# EAGLE design SimpleSwitchPirLightCO2 (EAGLE 6.6.0)
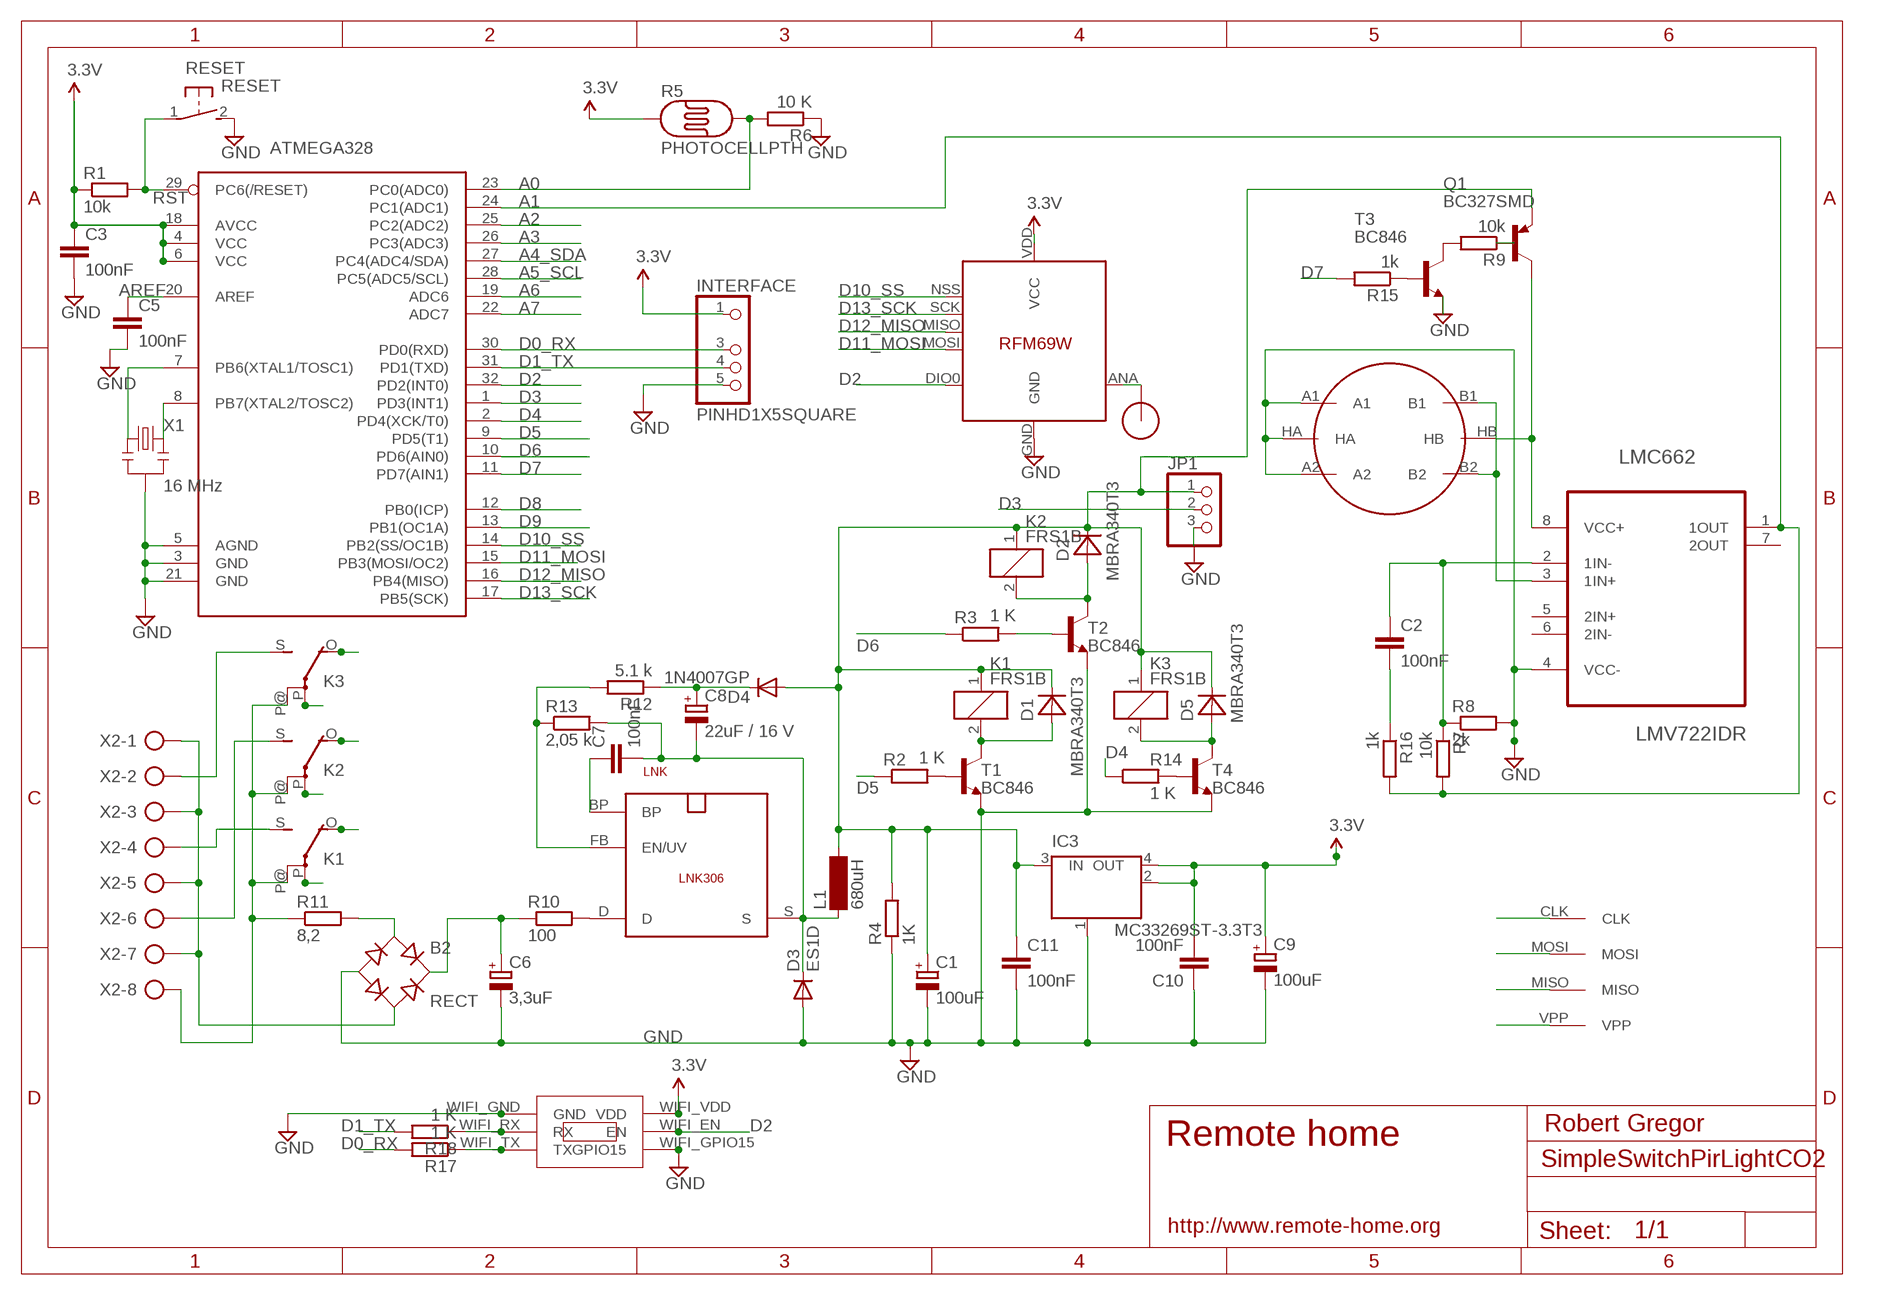
[diagram p0: schematic, sheet 1]

## Parts
ATMEGA328  ATMega-328  ATMEGA168/328TQFP32  [TQFP32-08]
B2  RECT  RECTIFIER-S40  [TO-269AA]
C1  100uF  CPOL-EUSMCB  [SMC_B]
C2  100nF  C-EUC2012  [C2012]
C3  100nF  C-EUC2012  [C2012]
C5  100nF  C-EUC2012  [C2012]
C6  3,3uF  CPOL-EUE5-10.5  [E5-10,5]
C7  100nF  C-EUC2012  [C2012]
C8  22uF / 16 V  CPOL-EUSMCC  [SMC_C]
C9  100uF  CPOL-EUSMCB  [SMC_B]
C10  100nF  C-EUC2012  [C2012]
C11  100nF  C-EUC2012  [C2012]
D1  MBRA340T3  [SMA]
D2  MBRA340T3  [SMA]
D3  ES1D  DIODE-DO214AC  [DO214AC]
D4  1N4007GP  DIODE-DO214AA  [DO214AA]
D5  MBRA340T3  [SMA]
IC3  MC33269ST-3.3T3  [SOT223]
INTERFACE  PINHD1X5SQUARE  [PINHD1X05-SQUARE]
JP1  PINHD-1X03_2.54-S  [1X03-S]
K1  FRS1B  [FRS1B]
K2  FRS1B  [FRS1B]
K3  FRS1B  [FRS1B]
L1  680uH  BS11  [BS11]
LMC662  LMV722IDR  [SOIC127P600X175-8N]
LNK  LNK306  SO-8C  [SO-8C]
Q1  BC327SMD  [SOT23-BEC]
R1  10k  R-EU_R2012  [R2012]
R2  1 K  R-EU_M2012  [M2012]
R3  1 K  R-EU_M2012  [M2012]
R4  1K  R-EU_M2012  [M2012]
R5  PHOTOCELLPTH  [PHOTOCELL]
R6  10 K  R-EU_M2012  [M2012]
R7  10k  R-EU_R2012  [R2012]
R8  2k  R-EU_R2012  [R2012]
R9  10k  R-EU_R2012  [R2012]
R10  100  R-EU_R2512W  [R2512W]
R11  8,2  R-EU_0411/12  [0411/12]
R12  5.1 k  R-EU_M2012  [M2012]
R13  2,05 k  R-EU_M2012  [M2012]
R14  1 K  R-EU_M2012  [M2012]
R15  1k  R-EU_R2012  [R2012]
R16  1k  R-EU_R2012  [R2012]
R17  1 K  R-EU_M2012  [M2012]
R18  1 K  R-EU_M2012  [M2012]
RESET  RESET  DTSM-3  [DTSM-3]
RFM69  RFM69W  [RFM69W]
T1  BC846  [SOT23]
T2  BC846  [SOT23]
T3  BC846  [SOT23]
T4  BC846  [SOT23]
U$1  RFM12B_ANTENNA  [RFM12B-ANTENNA]
U$2  AVRHEADERDIP  [AVRHEADER]
U$4  METHANE_SENSOR  [MQ-3]
U$5  ESP03  [ESP03]
X1  16 MHz  RESONATORSMD  [RESONATOR-SMD]
X2  AK500/8  [AK500/8]

## Nets
6V: C1.+ C11.1 D1.C D2.C D4.A D5.C IC3.3(IN) JP1.1 K1.1 K2.1 K3.1 L1.2 Q1.E R4.2
A0: ATMEGA328.23(PC0(ADC0)) R5.2 R6.2
A1: ATMEGA328.24(PC1(ADC1)) LMC662.1(1OUT) R7.2 R16.2
A2: ATMEGA328.25(PC2(ADC2))
A3: ATMEGA328.26(PC3(ADC3))
A4_SDA: ATMEGA328.27(PC4(ADC4/SDA))
A5_SCL: ATMEGA328.28(PC5(ADC5/SCL))
A6: ATMEGA328.19(ADC6)
A7: ATMEGA328.22(ADC7)
AREF: ATMEGA328.20(AREF) C5.1
D0_RX: ATMEGA328.30(PD0(RXD)) INTERFACE.3 R17.2
D1_TX: ATMEGA328.31(PD1(TXD)) INTERFACE.4 R18.2
D2: ATMEGA328.32(PD2(INT0)) RFM69.DIO0 U$5.WIFI_EN(EN)
D3: ATMEGA328.1(PD3(INT1)) JP1.2
D4: ATMEGA328.2(PD4(XCK/T0)) R14.1
D5: ATMEGA328.9(PD5(T1)) R2.1
D6: ATMEGA328.10(PD6(AIN0)) R3.1
D7: ATMEGA328.11(PD7(AIN1)) R15.2
D8: ATMEGA328.12(PB0(ICP))
D9: ATMEGA328.13(PB1(OC1A))
D10_SS: ATMEGA328.14(PB2(SS/OC1B)) RFM69.NSS(SEL)
D11_MOSI: ATMEGA328.15(PB3(MOSI/OC2)) RFM69.MOSI U$2.MOSI
D12_MISO: ATMEGA328.16(PB4(MISO)) RFM69.MISO U$2.MISO
D13_SCK: ATMEGA328.17(PB5(SCK)) RFM69.SCK U$2.CLK
FB: LNK.FB(EN/UV) R12.2 R13.1
GND [power]: ATMEGA328.3(GND) ATMEGA328.5(AGND) ATMEGA328.21(GND) B2.- C1.- C3.2 C5.2 C6.- C9.- C10.1 C11.2 D3.A IC3.1(GND/ADJ) INTERFACE.5 JP1.3 LMC662.4(VCC-) R4.1 R6.1 R8.2 RESET.2 RFM69.GND T1.2(E) T2.2(E) T3.2(E) T4.2(E) U$4.A1 U$4.A2 U$4.HA U$5.WIFI_GND(GND) U$5.WIFI_GPIO15(GPIO15) X1.2
N$1: ATMEGA328.7(PB6(XTAL1/TOSC1)) X1.1
N$2: R2.2 T1.1(B)
N$3: RFM69.ANA(ANT) U$1.P$1
N$4: LMC662.3(1IN+) U$4.B1 U$4.B2
N$5: D1.A K1.2 T1.3(C)
N$6 [220V]: K3.S(2:S) X2.2
N$7 [220V]: K2.S(2:S) X2.6
N$8 [220V]: K1.P@(2:P) K2.P@(2:P) K3.P@(2:P) R11.1 X2.8
N$9 [220V]: B2.AC2 X2.1 X2.3 X2.5 X2.7
N$10: D5.A K3.2 T4.3(C)
N$11: D2.A K2.2 T2.3(C)
N$12: R3.2 T2.1(B)
N$13 [220V]: LNK.D R10.2
N$14 [220V]: B2.+ C6.+ R10.1
N$15 [220V]: B2.AC1 R11.2
N$16 [220V]: K1.S(2:S) X2.4
N$17: C2.1 LMC662.2(1IN-) R7.1 R8.1
N$18: C7.1 LNK.BP
N$19: LMC662.8(VCC+) Q1.C U$4.HB
N$20: C8.+ D4.C R12.1
N$21: ATMEGA328.8(PB7(XTAL2/TOSC2)) X1.3
N$22: R15.1 T3.1(B)
N$23: R9.2 T3.3(C)
N$24: Q1.B R9.1
N$25: C2.2 R16.1
N$26 [220V]: K3.O(2:O)
N$27: R14.2 T4.1(B)
N$28: R17.1 U$5.WIFI_TX(TX)
N$29: R18.1 U$5.WIFI_RX(RX)
N$50 [220V]: K2.O(2:O)
N$51 [220V]: K1.O(2:O)
N$52 [220V]: K1.P(2:P)
N$53 [220V]: K2.P(2:P)
N$54 [220V]: K3.P(2:P)
RST: ATMEGA328.29(PC6(/RESET)) R1.2 RESET.1 U$2.VPP
S: C7.2 C8.- D3.C L1.1 LNK.S R13.2
VCC: ATMEGA328.4(VCC) ATMEGA328.6(VCC) ATMEGA328.18(AVCC) C3.1 C9.+ C10.2 IC3.2(OUT) IC3.4(OUT) INTERFACE.1 R1.1 R5.1 RFM69.VDD(VCC) U$5.WIFI_VDD(VDD) ; supply symbol labelled 3.3V
Unconnected: LMC662.5(2IN+) LMC662.6(2IN-) LMC662.7(2OUT)

## Notes on the sheet
- Robert Gregor
- Remote home
- http://www.remote-home.org

## Library data of the parts
ATMEGA328 = LowPowerLab:ATMEGA168/328: Atmel 32-pin 8-bit micro, 16k flash.
B2 = rectifier:RECTIFIER-: Rectifier
C1 C6 C8 C9 = resistor:CPOL-EU: POLARIZED CAPACITOR, European symbol
C2 C3 C5 C7 C10 C11 = resistor:C-EU: CAPACITOR, European symbol
D1 D2 D5 = diode:MBRA340T3: Surface Mount Schottky Power Rectifier Source: http://www.onsemi.com/pub_link/Collateral/MBRA340T3-D.PDF
D3 D4 = diode:DIODE-: DIODE
IC3 = linear:MC33269ST*: Adjustable Output Low Dropout Voltage Regulator 800 mA Source: http://www.onsemi.com/pub/Collateral/MC33269-D.PDF
INTERFACE = eagle-library-edeca.net-v5:PINHD1X5
JP1 = pinhead-2:PINHD-1X03: PIN HEADER
K1-K3 = relay:FRS1B: RELAY 1 x switch, same as V23101-D6-A201, Siemens; OC_FARNELL: unknown; OC_NEWARK: unknown
L1 = inductor-neosid:BS: INDUCTOR nominal inductance, magnetically screened; OC_FARNELL: unknown; OC_NEWARK: unknown
LMC662 = Texas Instruments_By_element14_Batch_1:LMV722IDR: OPERATIONAL AMPLIFIERS; MPN: LMV722IDR; OC_FARNELL: -; OC_NEWARK: 02M3640; PACKAGE: SOIC-8; SUPPLIER: Texas Instruments
LNK = powerint:SO-8C: 700V MOSFET für Schaltnetz-Trafos. Pin 3 fehlt. SMD
Q1 = transistor-pnp:BC327*: PNP Transistror
R1-R4 R6-R18 = resistor:R-EU_: RESISTOR, European symbol
R5 = SparkFun-Sensors:PHOTOCELL: CdS photoresistor. This is a low cost way to detect light levels. Resistance decreases with more incoming light. SparkFun SKU: SEN-09088
RESET = switch-tact:DTSM-3
RFM69 = RemoteHome:RFM69W
T1-T4 = transistor:BC846: NPN TRANSISTOR
U$1 = LowPowerLab:RFM12B_ANTENNA
U$2 = RemoteHome:AVRHEADER
U$4 = SparkFun-Sensors:METHANE_SENSOR: MQ-4 Methane Gas Sensor SEN-09404
U$5 = RemoteHome:ESP03
X1 = SparkFun:RESONATOR: Resonator Small SMD resonator. This is the itty bitty 10/20MHz resonators with built in caps. CSTCE10M0G55 and CSTCE20M0V53. Footprint has been reviewed closely but hasn't been tested yet.
X2 = con-ptr500:AK500/8: CONNECTOR; OC_FARNELL: unknown; OC_NEWARK: unknown

## Net classes
1 power: width 0.381 mm, clearance 0.254 mm
2 220V: width 0.381 mm, clearance 0.508 mm

## Board
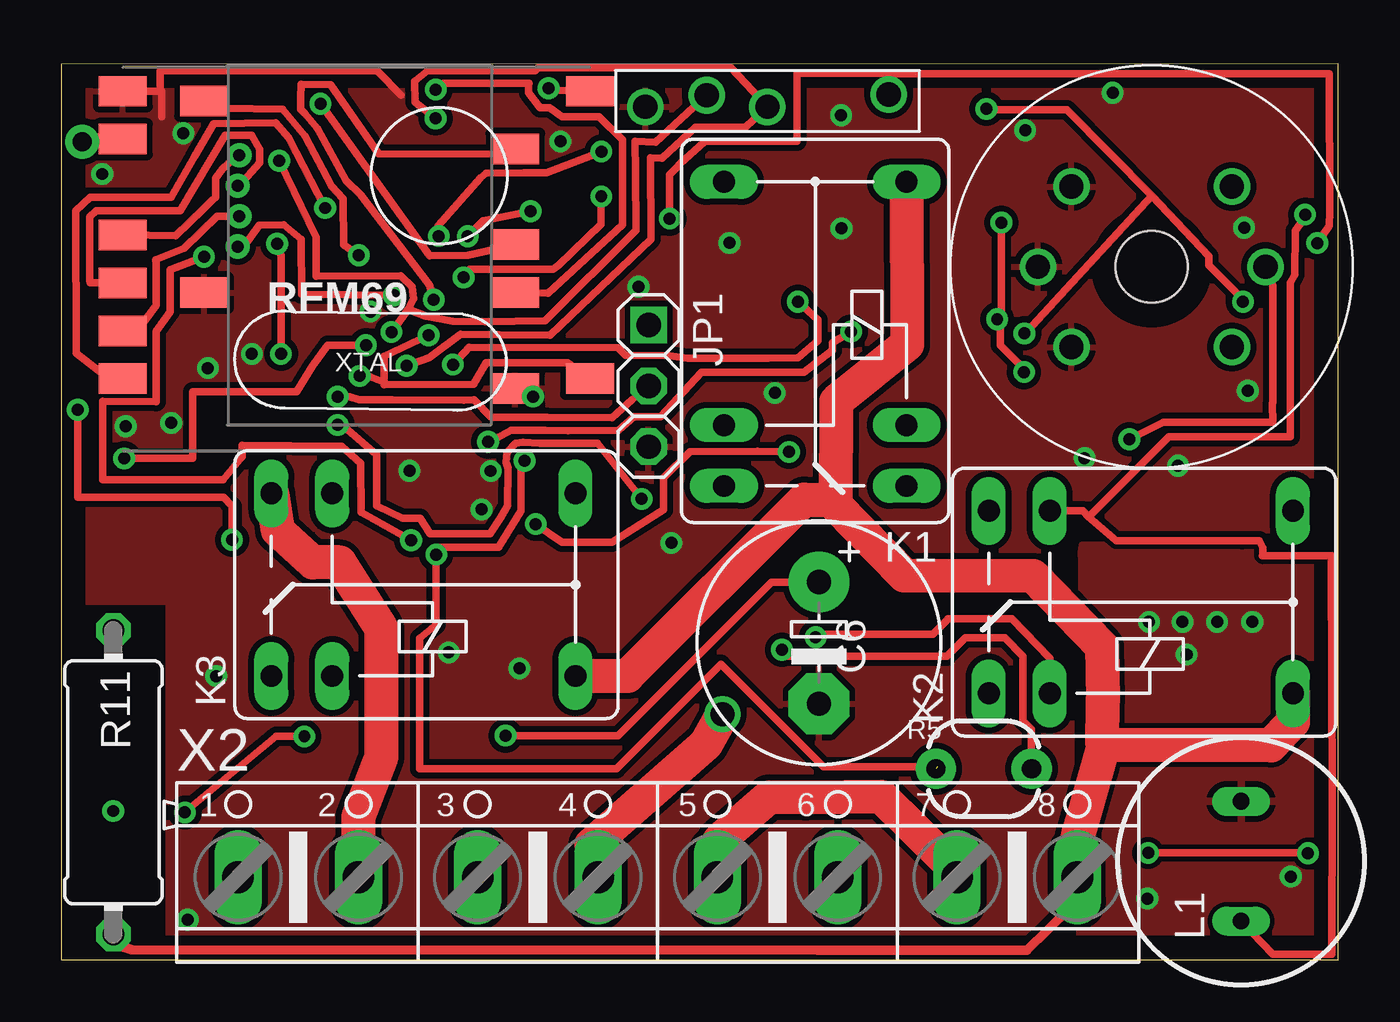
[diagram p1: board, top side]
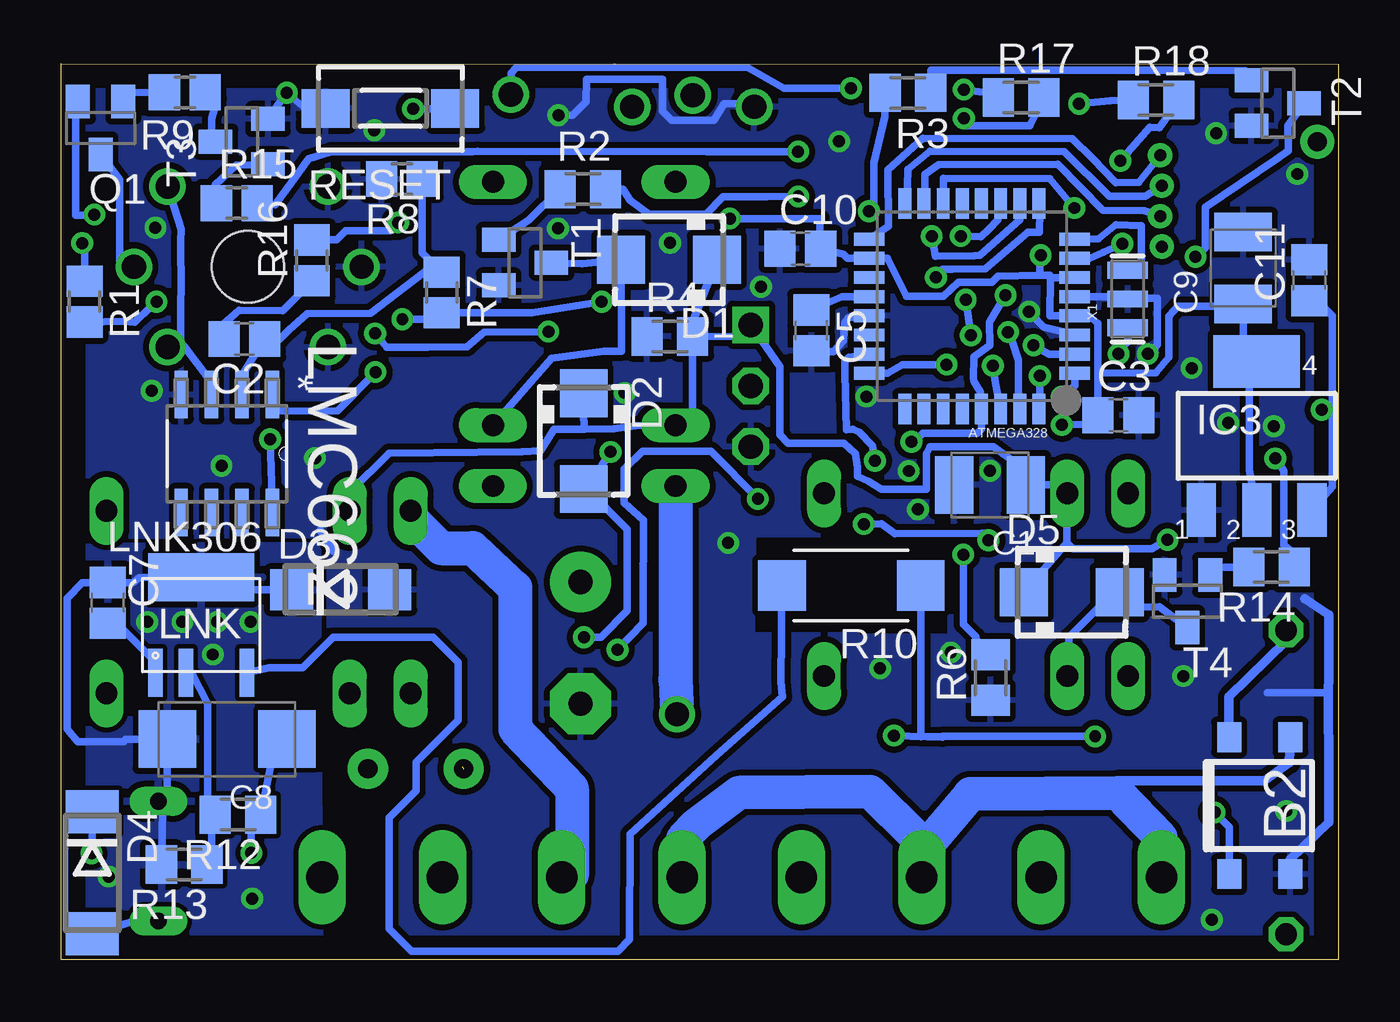
[diagram p2: board, bottom side, seen from below]

Size 53.33 x 37.42 mm. Coordinates in mm from the lower left corner, seen from the top.
Outline: 0,0 53.33,0 53.33,37.42 0,37.4 0,0
Copper layers (1*16): Top 0.035mm / dielectric 1.5mm / Bottom 0.035mm
Design rules "default": minimum track width 10mil, minimum drill 24mil, track to track 8mil, track to pad 8mil, pad to pad 8mil, via to via 8mil, smd to smd 8mil, copper to edge 40mil, drill to drill 8mil, minimum pad ring 10mil, minimum via ring 8mil, stop-mask expansion 4mil, vias tented up to drill 0mil, thermal gap 10mil

### Footprints (pad centres in the part's own frame; a part is rotated, then mirrored left to right if it is on the bottom)
TQFP32-08 = smd 1.27 x 0.533: 1 -4.293,2.8; 2 -4.293,2; 3 -4.293,1.2; 4 -4.293,0.4; 5 -4.293,-0.4; 6 -4.293,-1.2; 7 -4.293,-2; 8 -4.293,-2.8; 17 4.293,-2.8; 18 4.293,-2; 19 4.293,-1.2; 20 4.293,-0.4; 21 4.293,0.4; 22 4.293,1.2; 23 4.293,2; 24 4.293,2.8 | smd 0.533 x 1.27: 9 -2.8,-4.293; 10 -2,-4.293; 11 -1.2,-4.293; 12 -0.4,-4.293; 13 0.4,-4.293; 14 1.2,-4.293; 15 2,-4.293; 16 2.8,-4.293; 25 2.8,4.293; 26 2,4.293; 27 1.2,4.293; 28 0.4,4.293; 29 -0.4,4.293; 30 -1.2,4.293; 31 -2,4.293; 32 -2.8,4.293
TO-269AA = smd 1 x 1.25: + -1.28,-2.855; - 1.28,-2.855; AC1 -1.28,2.855; AC2 1.28,2.855
SMC_B = smd 1.6 x 2.4: + -1.5,0; - 1.5,0
C2012 = smd 1.3 x 1.5: 1 -0.85,0; 2 0.85,0
E5-10,5 = drill 1.016 pad 2.54: + -2.54,0 | drill 1.016 pad 2.54 octagon: - 2.54,0
SMC_C = smd 2.4 x 2.4: + -2.5,0; - 2.5,0
SMA = smd 2 x 2: A 2,0; C -2,0
DO214AC = smd 1.8 x 1.7: A 2.05,0; C -2.05,0
DO214AA = smd 1.8 x 2.2: A 2.55,0; C -2.55,0
SOT223 = smd 1.219 x 2.235: 1 -2.311,-3.099; 2 0,-3.099; 3 2.311,-3.099 | smd 3.6 x 2.2: 4 0,3.099
PINHD1X05-SQUARE = drill 1.016: 1 -5.061,-0.269; 3 0,0.24; 4 2.54,-0.24; 5 5.099,0.24
1X03-S = drill 1.016 square: 1 -2.54,0 | drill 1.016 octagon: 2 0,0; 3 2.54,0
FRS1B = drill 0.914 long: 1 0,3.81; 2 0,-3.81; O -2.54,-3.81; P 10.16,3.81; P@ 10.16,-3.81; S -2.54,3.81
BS11 = drill 0.7 long: 1 -2.5,0; 2 2.5,0
SOIC127P600X175-8N = smd 1.981 x 0.559: 1 -2.464,1.905; 2 -2.464,0.635; 3 -2.464,-0.635; 4 -2.464,-1.905; 5 2.464,-1.905; 6 2.464,-0.635; 7 2.464,0.635; 8 2.464,1.905
SO-8C = smd 0.6 x 2: BP -1.905,-2; D 1.905,-2; FB -0.635,-2 | smd 4.41 x 2: S 0,2
SOT23-BEC = smd 1 x 1.4: B -0.95,-1.1; C 0,1.1; E 0.95,-1.1
R2012 = smd 1.3 x 1.5: 1 -0.85,0; 2 0.85,0
M2012 = smd 1.3 x 1.6: 1 -0.95,0; 2 0.95,0
PHOTOCELL = drill 0.8 pad 1.676: 1 -2,0; 2 2,0
R2512W = smd 2 x 2.1: 1 -2.896,0; 2 2.896,0
0411/12 = drill 0.914 octagon: 1 -6.35,0; 2 6.35,0
DTSM-3 = smd 2 x 1.6: 1 -2.7,0; 2 2.7,0
RFM69W = smd 2 x 1.27: ANA 9.27,-5; DIO0 -10.23,5; GND 9.27,-7; MISO 9.27,1; MOSI 9.27,3; NSS 9.27,5; SCK 9.27,-1; VDD -10.23,-7
SOT23 = smd 1 x 1.4: 1 -0.95,-1.1; 2 0.95,-1.1; 3 0,1.1
RFM12B-ANTENNA = drill 0.8 pad 1.422: P$1 0,0
AVRHEADER = drill 0.5: CLK 2.54,0; MISO 1.27,0.07; MOSI 0,0; VPP -1.27,0.072
MQ-3 = drill 1.016: A1 -3.35,3.35; A2 -3.35,-3.35; B1 3.35,3.35; B2 3.35,-3.35; HA -4.75,0; HB 4.75,0 | hole 3: 0,0
ESP03 = smd 1.27 x 2: WIFI_EN 3.27,-6; WIFI_GND -6.73,-6; WIFI_GPIO15 -2.73,7; WIFI_RX -0.73,-6; WIFI_TX -2.73,-6; WIFI_VDD 5.27,7
RESONATOR-SMD = smd 0.7 x 1.7: 1 -1.2,0; 2 0,0; 3 1.2,0
AK500/8 = drill 1.321 long: 1 -17.526,0; 2 -12.497,0; 3 -7.518,0; 4 -2.489,0; 5 2.489,0; 6 7.518,0; 7 12.497,0; 8 17.526,0

### Placement (x,y rotation side)
ATMEGA328  15.31,27.29 180 bottom
B2  3.29,6.44 0 bottom
C1  14.56,19.83 180 bottom
C2  45.69,25.92 180 bottom
C3  9.19,22.74 0 bottom
C5  22.01,26.28 270 bottom
C6  31.65,13.23 270 top
C7  51.4,14.91 90 bottom
C8  46.41,9.22 180 bottom
C9  3.98,28.88 90 bottom
C10  22.47,29.69 0 bottom
C11  1.22,28.37 90 bottom
D1  27.96,29.23 180 bottom
D2  31.52,21.66 270 bottom
D3  41.67,15.45 0 bottom
D4  52.04,3.64 270 bottom
D5  11.14,15.35 0 bottom
IC3  3.42,21.88 0 bottom
INTERFACE  29.5,35.86 180 top
JP1  24.54,23.97 270 top
K1  31.5,22.32 90 top
K2  41.29,14.94 0 top
K3  11.32,15.66 0 top
L1  49.28,4.12 270 top
LMC662  46.42,21.13 270 bottom
LNK  47.49,13.98 0 bottom
Q1  51.7,34.73 180 bottom
R1  52.36,27.48 270 bottom
R2  31.55,32.17 180 bottom
R3  17.98,36.2 0 bottom
R4  27.92,26.03 0 bottom
R5  38.53,7.98 180 top
R6  14.53,11.79 90 bottom
R7  37.45,27.86 270 bottom
R8  39.11,32.6 180 bottom
R9  48.18,36.21 0 bottom
R10  20.34,15.63 180 bottom
R11  2.19,7.42 90 top
R12  45.96,6.06 180 bottom
R13  48.2,3.98 180 bottom
R14  2.8,16.4 180 bottom
R15  46.01,31.59 0 bottom
R16  42.87,29.2 90 bottom
R17  13.25,36 0 bottom
R18  7.62,35.9 0 bottom
RESET  39.59,35.55 180 bottom
RFM69  11.85,29.26 180 top
T1  33.97,29.11 270 bottom
T2  2.53,35.77 270 bottom
T3  45.8,34.16 90 bottom
T4  6.31,14.98 180 bottom
U$1  0.89,34.16 0 top
U$2  7.45,31.05 90 top
U$4  45.54,28.93 0 top
U$5  12.97,30.59 90 top
X1  8.81,27.59 90 bottom
X2  24.92,3.45 0 top

### Tracks (layer width: path | path; a pad name or v marks a point on that pad's centre or on a via)
6V  (via drill 0.5)
  Top 0.305: v51.95,31.11 52.03,31.11 51.55,30.44 51.52,28.6 51.33,28.27 51.34,21.83 46.25,21.83 42.93,18.51 42.9,18.51 | K2.1 42.67,18.74 42.9,18.51 | 50.19,16.88 53.06,16.88 53.06,16.64 53.05,16.64 53.09,6.78 53.07,0.24 50.61,0.23 L1.2 | 50.17,16.88 50.19,16.88 | 50.19,16.88 50.19,17.2 50.04,17.49 49.32,17.49 44.06,17.51 42.9,18.51 | v0.7,22.97 0.7,19.32 6.8,19.32 7.14,18.94 v7.14,17.54
  Bottom 0.305: Q1.E 52.73,35.68 52.73,31.09 51.95,31.09 v51.95,31.11 | R4.2 25.22,26 JP1.1 23.88,25.57 23.32,24.76 23.32,21.93 23,21.57 20.66,21.57 20.18,21.12 20.08,20.57 20.09,20.2 19.63,19.98 19.09,19.65 17.21,19.65 17.21,21.14 17.06,21.42 14.41,21.42 13.38,20.68 13.38,19.74 C1.+ 11.32,19.83 K3.1 | R4.2 26.98,22.97 K1.1 29.35,22.31 30.26,22.17 31.49,22.16 | D1.C 26.97,26.62 R4.2 | D4.A 50.31,1.61 L1.2 | K2.1 41.27,18.76 41.27,19.54 39.66,21.15 34.1,21.22 33.32,21.26 32.75,22.16 31.49,22.16 | C11.1 0.89,27.52 0.26,26.89 0.26,21.45 | 0.26,21.45 0.26,19.76 IC3.3 | v0.7,22.97 0.27,22.91 0.26,21.45 | D5.C 11.34,17.41 | 11.34,17.41 K3.1 | D2.C 31.52,22.63 31.49,22.16 | K3.1 11.33,18.74 | v7.14,17.54 7.79,17.16 11.1,17.16 11.34,17.41
A0  (via drill 0.5)  (1 unrouted)
  Top 0.305: 36.61,8.06 31.84,8.06 27.55,12.35 23.19,7.99 14.97,7.99 14.97,13.43 15.67,13.99 v15.67,16.92 15.66,17.22 16.11,17.22 18.28,17.23 19.21,18.75 19.22,20.77 v19.36,20.84
  Bottom 0.305: ATMEGA328.23 20.45,25.16 20.62,25 20.6,24.47 20.55,22.14 20.28,22.16 20.01,22.04 19.46,21.47 v19.36,20.84 | R6.2 15.13,13.39 15.13,13.48 15.67,14.02 v15.67,16.92
A1  (via drill 0.5)
  Top 0.305: v39.27,30.78 39.27,26.92 v39.09,26.74 39.24,26.6 39.24,25.65 40.21,24.68 v40.21,24.54 | v30.77,27.48 31.61,26.73 31.61,25.85 30.77,25.13 29.55,25.12 26.19,25.11 25.4,25.21 23.58,25.24 23.27,25.56 17.05,25.57 v16.37,24.85
  Bottom 0.305: R16.2 41.84,30.05 41.46,30.43 39.61,30.43 v39.27,30.78 | v39.09,26.74 37.72,26.74 R7.2 33.68,27.01 v30.77,27.48 | v16.37,24.85 18.22,24.86 18.83,24.49 ATMEGA328.24 | LMC662.1 44.64,22.76 44.38,22.91 41.8,22.92 v40.21,24.54
AREF
  Bottom 0.305: ATMEGA328.20 20.73,27.69 C5.1
D0_RX  (via drill 0.5)
  Top 0.305: v14.44,24.8 15.38,25.14 16.69,26.11 18.29,26.09 20.42,26.08 24.65,30.09 24.63,33.49 25.09,33.47 26.51,34.76 28.6,34.78 INTERFACE.3 27.97,37.24 27.78,37.24 27.78,37.25 19.93,37.24 19.81,37.11 15.32,37.11 14.77,36.69 14.79,35.81 v15.65,35.13
  Bottom 0.305: ATMEGA328.30 14.32,24.09 v14.44,24.8 | R17.2 12.88,34.83 15.57,34.81 v15.65,35.13
D1_TX  (via drill 0.5)
  Top 0.305: v13.8,26.21 14.5,27.17 | 14.5,27.17 14.73,27.6 14.66,28.11 14.18,28.56 10.66,28.53 10.66,30.17 v9.11,33.36 | 23.99,32.89 24,30.46 20.21,26.68 17.72,26.65 16.35,26.66 15.24,26.87 14.5,27.17 | 23.99,32.89 23.98,34.17 24.83,34.14 INTERFACE.4 | 23.98,32.88 23.99,32.89
  Bottom 0.305: v13.8,26.21 13.65,25.87 13.38,25.04 13.37,23.05 | R18.2 7.49,34.74 7.89,34.75 v9.11,33.36
  Bottom 0.406: ATMEGA328.31 13.37,22.99 13.37,23.05
D2  (via drill 0.5)
  Top 0.305: RFM69.DIO0 21.15,24.92 17.76,24.92 17.23,24.02 13.49,24.02 | 13.49,24.02 13.42,24.14 12.92,24.35 v12.47,24.38 | U$5.WIFI_EN 18.52,33.86 18.3,33.64 13.27,33.65 11.26,36.54 10.03,36.55 10.01,35.99 10.01,35.51 10.18,35.34 10.71,34.7 11.91,32.53 12.51,31.93 15.39,28.17 v15.57,27.56 | v15.35,26.08 13.49,25.2 13.49,24.02
  Bottom 0.305: v12.47,24.38 12.47,23.03 ATMEGA328.32 | v15.57,27.56 v15.35,26.08
D3  (via drill 0.5)
  Top 0.305: v11.55,23.51 12.05,23.51 12.46,23.39 13.84,23.38 16.81,23.35 17.26,23.39 17.97,22.66 20.3,22.65 23.01,22.64 23.84,23.38 24.18,23.65 24.47,23.93 JP1.2
  Bottom 0.305: ATMEGA328.1 11.02,23.97 v11.55,23.51
D4  (via drill 0.5)
  Top 0.305: v12.73,25.66 11.13,25.65 10.51,24.79 9.84,23.72 9.56,23.72 8.55,23.72 5.5,23.71 5.49,20.95 v2.64,20.94
  Bottom 0.305: ATMEGA328.2 12.1,25.29 v12.73,25.66 | R14.1 1.66,16.82 2.3,17.3 2.3,20.41 v2.64,20.94
D5  (via drill 0.5)
  Top 0.305: v22.56,31.87 22.55,30.7 20.79,28.99 20.56,28.83 18.15,28.83 17.06,28.83 v16.82,28.49
  Bottom 0.305: v16.82,28.49 16.71,28.54 16.67,28.58 16.55,28.84 16.14,28.84 14.74,28.86 12.98,30.39 12.5,30.39 12.47,31.23 12.52,31.57 ATMEGA328.9 | R2.1 29.87,32.17 29.59,31.71 28.78,31.13 26.41,31.14 25.7,31.86 23.87,31.86 v22.56,31.87
D6  (via drill 0.5)
  Top 0.305: v16.99,30.21 17.64,30.85 v19.61,31.25
  Bottom 0.305: ATMEGA328.10 13.31,30.96 13.3,30.9 14.97,29.43 15.2,29.4 16.83,29.39 v16.99,30.21 | R3.1 18.93,35.21 19.4,33.27 19.4,31.24 v19.61,31.25
D7  (via drill 0.5)
  Top 0.305: v15.78,30.22 15.75,30.65 17.53,32.65 17.75,32.84 19.33,32.85 20.27,32.86 v22.56,33.74
  Bottom 0.305: ATMEGA328.11 14.22,30.89 14.59,30.51 14.93,30.19 v15.78,30.22 | v22.56,33.74 23.72,33.75 26.38,33.74 35.95,33.75 36.15,33.74 42.06,33.74 43,33.44 43.71,32.45 44.4,31.53 R15.2
D9
  Bottom 0.305: ATMEGA328.13
D10_SS  (via drill 0.5)
  Top 0.305: RFM69.NSS 1.95,24.31 0.63,25.33 0.61,31.27 1.23,31.85 4.6,31.83 5.59,33.54 6.38,34.91 8.96,34.94 9.5,34.33 v11.03,31.39
  Bottom 0.305: ATMEGA328.14 16.51,32.62 12.04,32.6 v11.03,31.39
D11_MOSI
  Top 0.305: RFM69.MOSI 3.22,26.31 3.97,27.32 3.97,29.06 3.95,29.23 5.15,29.7 6.52,31.05 7.05,31.04 U$2.MOSI
  Bottom 0.305: ATMEGA328.15 17.28,31.61 17.28,32.79 16.7,33.19 11.71,33.21 9.84,31.3 8.11,31.28 U$2.MOSI
D12_MISO
  Top 0.305: 3.07,28.31 RFM69.MISO 2.58,28.27 1.22,28.27 1.21,28.36 1.21,31.03 1.47,31.28 4.98,31.28 6.85,34.42 7.96,34.42 8.31,33.83 8.31,33.28 7.44,32.32 U$2.MISO
  Bottom 0.305: ATMEGA328.16 18.01,31.64 17.99,33.01 17.07,33.75 11.45,33.74 9.57,31.87 8.06,31.87 U$2.MISO
D13_SCK
  Top 0.305: RFM69.SCK 4.8,30.22 5.94,31.35 6.32,31.72 6.45,31.83 6.45,32.63 6.72,33 7.01,33.28 U$2.CLK
  Bottom 0.305: 19.81,30.19 19.71,30.09 ATMEGA328.17 18.8,30.63 18.81,32.99 17.36,34.3 11.12,34.28 10.29,33.46 9.29,32.45 8.34,32.46 U$2.CLK
FB
  Bottom 0.305: R13.1 47.04,3.96 47.06,3.99 47.06,5.58 R12.2 46.87,6.45 47.22,6.45 47.22,8.79 47.21,10.7 47.9,11.98 LNK.FB
GND  (via drill 0.5)
  Top 0.305: 24.41,35.75 24.25,35.75 | 14.2,36.09 13.21,37.11 4.14,37.11 4.14,36.26 | RFM69.GND 4.14,36.26 | 4.14,36.26 4.21,36.26 4.21,35.19
  Bottom 0.305: ATMEGA328.21 20.47,26.82 20.63,26.59 20.68,25.85 21.1,25.38 21.84,25.38 C5.2 | RESET.2 43.15,35.55 v43.92,36.2 44.67,35.16 T3.2 | ATMEGA328.5 8.9,27.69 X1.2 | 7.94,25.24 7.57,25.68 7.57,27.62 8.98,27.62 8.98,27.63 | 24.41,35.75 25.66,35.75 26.08,35.05 27.84,35.05 28.23,35.43 28.23,36 28.23,36.02 28.23,36.77 31.41,36.76 31.42,35.83 31.99,35.26 v32.58,35.26 | ATMEGA328.3 11.05,26.11 12.31,26.4 v12.92,27.06 | 2.97,11.15 0.41,11.15 0.41,11.47 0.42,11.44 | 42.52,17.93 41.99,17.05
  Bottom 0.406: B2.- 2.01,4.21 0.4,5.75 0.4,7.4 0.42,11.44 0.42,11.58 0.41,14.41 1.4,15.07 | 5.84,18.77 IC3.1
  other vias: 49.41,30.56 7.97,25.3 32.59,30.54 27.92,29.93 1.72,32.81 2.18,6.22 24.12,28.1 17.57,18.81 42.74,20.95 46.64,20.63 49.56,23.76 40.26,34.63 20.85,34.17 25.49,17.41 16.19,12.84 6.48,11.85 5.29,1.68 19.14,12.17 29.81,23.67 4.6,22.42 2.7,22.28 6.13,24.7 17.95,20.41 14.55,20.42 5.11,34.51 19.71,23.52
  pour Top: 0.29,37.19 53.15,37.18 53.12,17.73 49.74,17.75 42.19,17.72 42.19,0.17 30.08,0.11 28.57,0.18 4.53,0.21 4.5,0.15 4.5,14.94 0.22,14.94 0.25,15.3
  pour Bottom: 7.26,37.22 53.12,37.07 53.18,19.62 53.08,17.69 42.14,17.73 42.14,0.21 20.1,0.18 20.08,13.54 24.48,13.54 24.43,17.77 16.26,17.75 16.24,13.49 19.83,13.49 19.89,0.17 0.23,0.24 0.19,37.25
N$1  (via drill 0.5)
  Top 0.305: v9.19,25.3 9.19,29.39 v9.03,29.9
  Bottom 0.305: X1.1 8.81,25.8 v9.19,25.3 | v9.03,29.9 9.83,29.53 10.43,29.28 ATMEGA328.7
N$2
  Bottom 0.305: R2.2 33.83,30.89 T1.1
N$3
  Top 0.305: RFM69.ANA 2.48,34.26
  Top 0.61: 2.48,34.26 U$1.P$1
N$4
  Bottom 0.305: U$4.B1 48.32,30.51 48.35,29.98 48.33,27.96 48.35,27.52 48.35,25.63 U$4.B2 48.33,25.6 48.2,25.63 47.17,24.24 LMC662.3
N$5
  Bottom 0.305: T1.3 31.59,29.07 D1.A 29.93,25.41 30.7,25.42 32.86,25.11 K1.2
N$6
  Top 1.422: X2.2 12.42,5.97 13.38,8.46 13.38,13.84 11.64,16.59 10.52,16.59 9.06,17.92 8.83,19.43 K3.S
N$7
  Bottom 1.422: K2.S 38.75,18.45 37.48,17.19 36.15,17.19 34.38,15.54 34.38,9.64 32.02,7.15 32.02,3.54 X2.6
N$8
  Top 0.406: R11.1 2.37,0.61 2.96,0.42 31.58,0.41 40.33,0.4 42.11,2.14 X2.8
  Top 1.422: K1.P@ 35.33,25.69 32.37,23.31 32.35,19.01 | 32.35,19.01 35.22,16.05 40.61,16.03 43.47,13.08 43.5,10.87 43.51,10.83 43.49,8.96 | K2.P@ 51.45,9.93 50.53,8.96 43.49,8.96 | 43.49,8.96 43.5,8.87 42.68,5.92 42.45,5.13 X2.8 | K3.P@ 23.66,11.85 31.03,19.22 32.34,19.22 32.35,19.01
N$9
  Top 1.422: X2.7 37.1,4.03 34.28,6.81 31.09,6.77 29.56,6.79 27.51,5.02 X2.5
  Bottom 0.406: B2.AC2 2.05,8.23 3.09,7.49 9.17,7.49 7.44,5.11
  Bottom 1.422: X2.3 17.36,4.58 | 17.36,4.58 17.62,5.13 19.55,7.02 25.04,6.98 26.78,5.67 27.39,5.03 X2.5 | X2.1 7.44,5.11 9.21,6.96 15.37,6.92 17.36,4.58
N$10
  Bottom 0.305: K3.2 11.25,11.93 11.25,13.47 9.02,15.7 D5.A 9.08,15.67 9.08,14.7 7.48,14.75 T4.3
N$11  (via drill 0.5)
  Top 0.305: K2.2 41.29,12.6 39.7,14.24 37.04,14.24 37.04,14.23 36.41,13.6 31.64,13.6 v31.52,13.47 | v30.4,21.21 29.09,21.24 26.26,21.21 25.16,20.14 25.16,18.8 23.01,17.44 20.92,17.44 v19.83,18.2 | v14.62,17.52 12.52,18.69 12.5,20.74 11.72,21.45 7.57,21.49 7.57,21.01 6.77,20.05 5.35,20.05 5.33,20.04 1.75,20.04 1.75,23.31 3.97,23.31 3.97,26.25 4.57,27.05 4.57,28.37 4.56,28.47 4.56,28.8 v5.97,29.35
  Bottom 0.305: v31.52,13.47 30.79,13.47 29.7,14.59 29.7,17.98 31.38,19.66 | T2.3 2.11,34.82 2.11,33.79 2.59,33.42 5.56,31.43 5.56,29.72 v5.97,29.35 | D2.A 31.38,19.66 | 31.38,19.66 v30.4,21.21 | v19.83,18.2 19.08,18.2 18.52,17.79 14.89,17.81 14.75,17.8 14.67,17.75 v14.62,17.52
N$12
  Bottom 0.305: T2.1 3.89,37.12 6.79,37.13 15.82,37.13 17.03,37.13 R3.2
N$13
  Bottom 0.305: R10.2 23.28,11.59 23.22,11 25.97,8.55 29.58,5.26 29.61,0.86 30.09,0.37 38.71,0.37 39.64,1.31 39.64,5.93 38.52,7.05 38.52,8.25 36.77,10 36.77,12.43 37.81,13.47 41.99,13.47 43.26,12.2 44.66,12.2 LNK.D
N$14  (via drill 0.5)
  Top 0.305: v5.17,6.16 8.98,9.33 v10.16,9.33 | C6.+ 29.67,15.77 23.26,9.37 v18.56,9.37
  Bottom 0.305: B2.+ 4.57,5.55 v5.17,6.16 | v10.16,9.33 16.51,9.33 | 16.51,9.33 17.45,9.33 R10.1 | v18.56,9.37 16.55,9.29 16.51,9.33
N$15
  Bottom 0.406: R11.2 2.19,13.33 4.58,10.98 4.58,9.36 B2.AC1
N$16  (via drill 1)
  Top 1.422: v27.62,10.25 26.92,8.99 22.15,4.81 22.15,3.51 X2.4
  Bottom 1.422: K1.S 27.69,11.7 v27.62,10.25
N$17
  Bottom 0.305: LMC662.2 45.77,24.45 C2.1 44.21,25.91 43.83,26.29 43.07,26.98 40.41,27 37.85,28.95 R7.1 38.26,29.52 R8.1
N$18
  Bottom 0.305: C7.1 51.02,14.06 49.39,12.43 49.39,11.34 LNK.BP
N$19  (via drill 0.5)
  Top 0.305: U$4.HB 50.6,28.17 50.6,23.28 50.59,23.22 50.6,22.45 46.04,22.45 v44.62,21.74
  Bottom 0.305: Q1.C 50.89,32.56 50.89,29.21 U$4.HB | LMC662.8 44.57,20.51 v44.62,21.74
N$20  (via drill 0.5)
  Top 0.305: v45.4,4.47 51.69,4.47 v52.07,4.45
  Bottom 0.305: 51.95,6.28 D4.C 52.04,4.43 v52.07,4.45 | C8.+ 44.45,8.77 R12.1 45.4,6.06 v45.4,4.47
N$21
  Bottom 0.305: ATMEGA328.8 10.79,30.08 10.03,30.11 9.3,30.69 8.24,30.66 8.23,28.9 X1.3
N$22
  Bottom 0.305: T3.1 46.04,33.17 46.91,32.36 46.91,31.69 R15.1
N$23
  Bottom 0.305: R9.2 46.83,35.95 47.06,35.12 47.06,34.31 T3.3
N$24
  Bottom 0.305: Q1.B 50.42,36.2 R9.1
N$25
  Bottom 0.305: C2.2 46.57,26.54 45.9,27.13 44.09,27.1 42.86,28.32 43.3,28.37 R16.1
N$27
  Bottom 0.305: R14.2 5.04,16.4 T4.1
N$28  (via drill 0.5)
  Top 0.305: U$5.WIFI_TX 20.34,27.83 23.44,30.7 23.44,34.24 22.48,35.2 20.92,35.2 20.4,35.57 20.01,35.57 19.53,36.19 19.53,36.59 19.55,36.6 15.97,36.6 v15.65,36.33
  Bottom 0.305: v15.65,36.33 14.7,36.21 R17.1
N$29  (via drill 0.5)
  Top 0.305: U$5.WIFI_RX 17,29.42 15.38,29.4 v10.83,35.75
  Bottom 0.305: v10.83,35.75 9.52,35.87 R18.1
RST  (via drill 0.5)
  Top 0.305: U$2.VPP 7.64,29.78 8.27,30.67 9.29,30.68 10.03,30.08 10.05,27.79 v13.9,27.74 | v49.36,27.48 49.36,27.57 47.93,29.01 47.93,29.37 45.54,31.91 | 45.54,31.91 42,35.49 38.94,35.49 v38.65,35.53 | v17.84,21.63 17.92,21.63 18.79,22.12 20.22,22.1 21.18,22.1 23.28,22.1 23.94,22.67 25.04,22.67 26.74,24.54 31.03,24.54 32.21,25.46 32.21,25.77 v32.99,26.23 | v40.23,26.16 40.54,26.45 45.54,31.91
  Bottom 0.305: v13.9,27.74 14.58,26.62 14.57,25.65 15.23,25.19 15.25,24.29 15.23,24.16 15.03,23.84 14.96,23.72 14.97,23.59 14.88,23.03 ATMEGA328.29 14.92,22.16 15.08,21.99 17.35,21.99 17.72,21.63 v17.84,21.63 | R1.2 50.72,26.66 50.27,26.63 50.05,26.83 v49.36,27.48 | v38.65,35.53 36.91,35.53 RESET.1 | v32.99,26.23 35.68,26.21 36.38,25.6 38.03,25.58 38.44,25.58 39.76,25.58 v40.23,26.16
S  (via drill 0.5)
  Bottom 0.305: D3.C 47.32,15.45 LNK.S 50.08,15.96 50.36,15.75 C7.2 52.47,15.75 53.09,15.09 53.09,9.62 52.65,9.12 50.73,9.12 50.64,9.22 C8.- 48.91,6.79 L1.1 49.11,6.36 R13.2
  other vias: 47.01,12.75 45.44,14.11 46.83,14.11 48.28,14.11 49.74,14.11 45.37,2.56 51.35,3.48
  pour Bottom: 43.55,17.31 53.09,17.28 53.05,0.27 42.54,0.22 42.62,16.78 42.63,17.13 42.63,17.3
  pour Top: 42.66,17.3 53.08,17.32 53.05,0.24 42.54,0.26 42.63,16.56 42.62,17.01
VCC  (via drill 0.5)
  Top 0.305: v52.46,29.93 52.95,30.66 52.99,31.26 52.97,36.99 34.56,37 INTERFACE.1 34.57,37.01 30.74,37.01 30.74,34.17 26.88,34.15 25.86,33.23 25.68,33.05 25.42,32.78 v25.42,30.95 | RFM69.VDD 20.49,36.31 v20.36,36.39 | R5.1 40.53,9.63 40.18,9.99 40.18,12.68 39.42,13.44 37.76,13.44 37,12.68 30.37,12.68 v30.1,12.95 | v24.25,19.24 22.4,21.56 19.99,21.57 19.3,21.61 18.99,21.57 18.62,21.19 18.58,20.77 18.67,20.52 18.64,18.96 18.36,18.45 17.92,17.78 15.41,17.78 15,18.44 14.26,18.44 13.19,18.95 13.18,21.08 11.83,22.26 11.66,22.3 v11.55,22.34 11.52,22.31 | U$5.WIFI_VDD 6.81,35.55 9.26,35.52 10.19,34.38 11.29,32.3 11.79,31.77 11.8,29.85 v12.44,29.41
  Bottom 0.305: 10.06,24.3 10.06,23.32 10.06,22.85 C3.1 10,22.74 10,22.36 v11.55,22.34 | 10.06,24.3 10.05,26.57 10.38,26.85 10.97,26.93 ATMEGA328.4 12.05,26.89 12.03,28.49 | R1.1 52.36,29.58 v52.46,29.93 | 12.03,28.49 ATMEGA328.6 | 12.49,28.57 12.06,28.58 12.03,28.49 | IC3.2 3.73,20.47 3.73,24.01 IC3.4 3.98,25.41 C9.+ 4.17,27.19 5,27.28 6.7,27.28 7.08,26.86 7.08,25.15 7.62,24.5 9.89,24.49 10.06,24.3 | v20.36,36.39 23.16,36.38 24.67,37.24 30.24,37.27 34.34,37.24 34.56,37.01 INTERFACE.1 | v30.1,12.95 29.04,14.05 29.05,14.82 29.02,18.35 29.83,19.09 29.83,20.48 29.07,21.24 26.21,21.24 v24.25,19.24 | v25.42,30.95 21.66,30.95 21.65,29.46 C10.2 20.68,29.47 20.5,29.28 20.49,29.29 ATMEGA328.18 18.83,29.3 18.04,27.7 16.51,27.7 15.88,28.3 14.47,28.3 14.22,28.55 12.49,28.57 | v12.44,29.41 12.49,28.57